# EAGLE design tweeq-Proto_BLE (EAGLE 6.4)
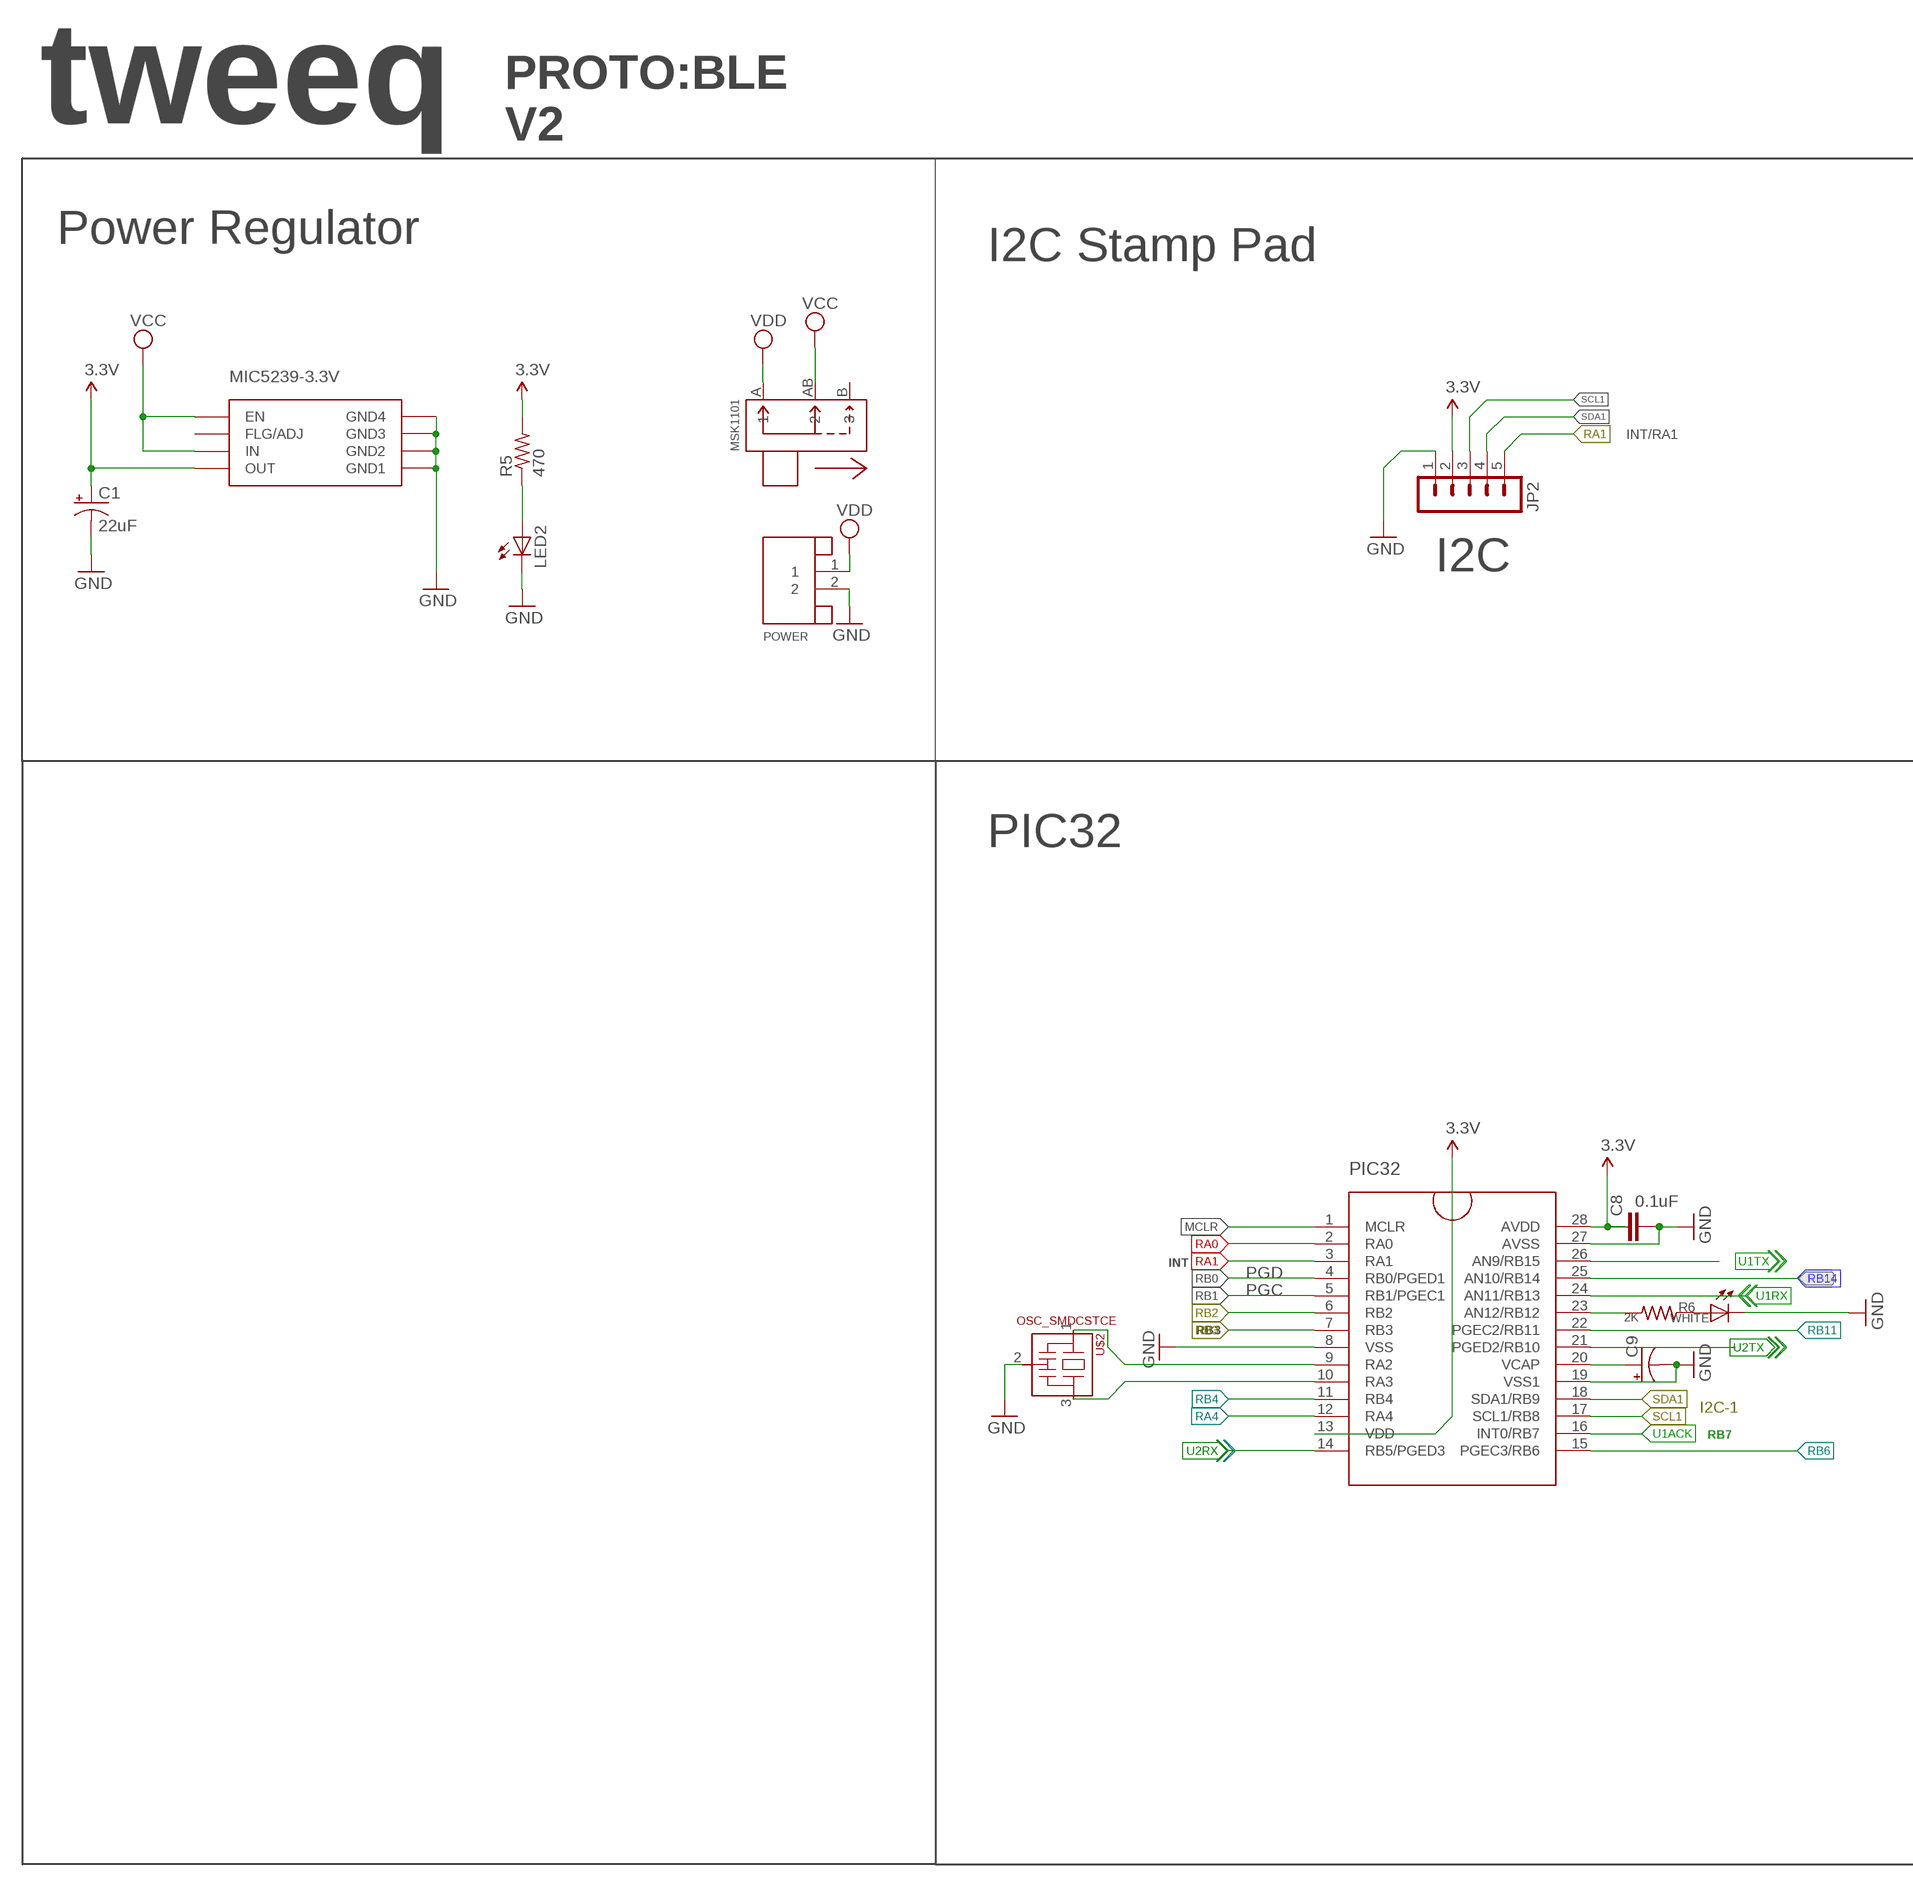
[diagram p0: schematic, sheet 1, part 1 of 2]
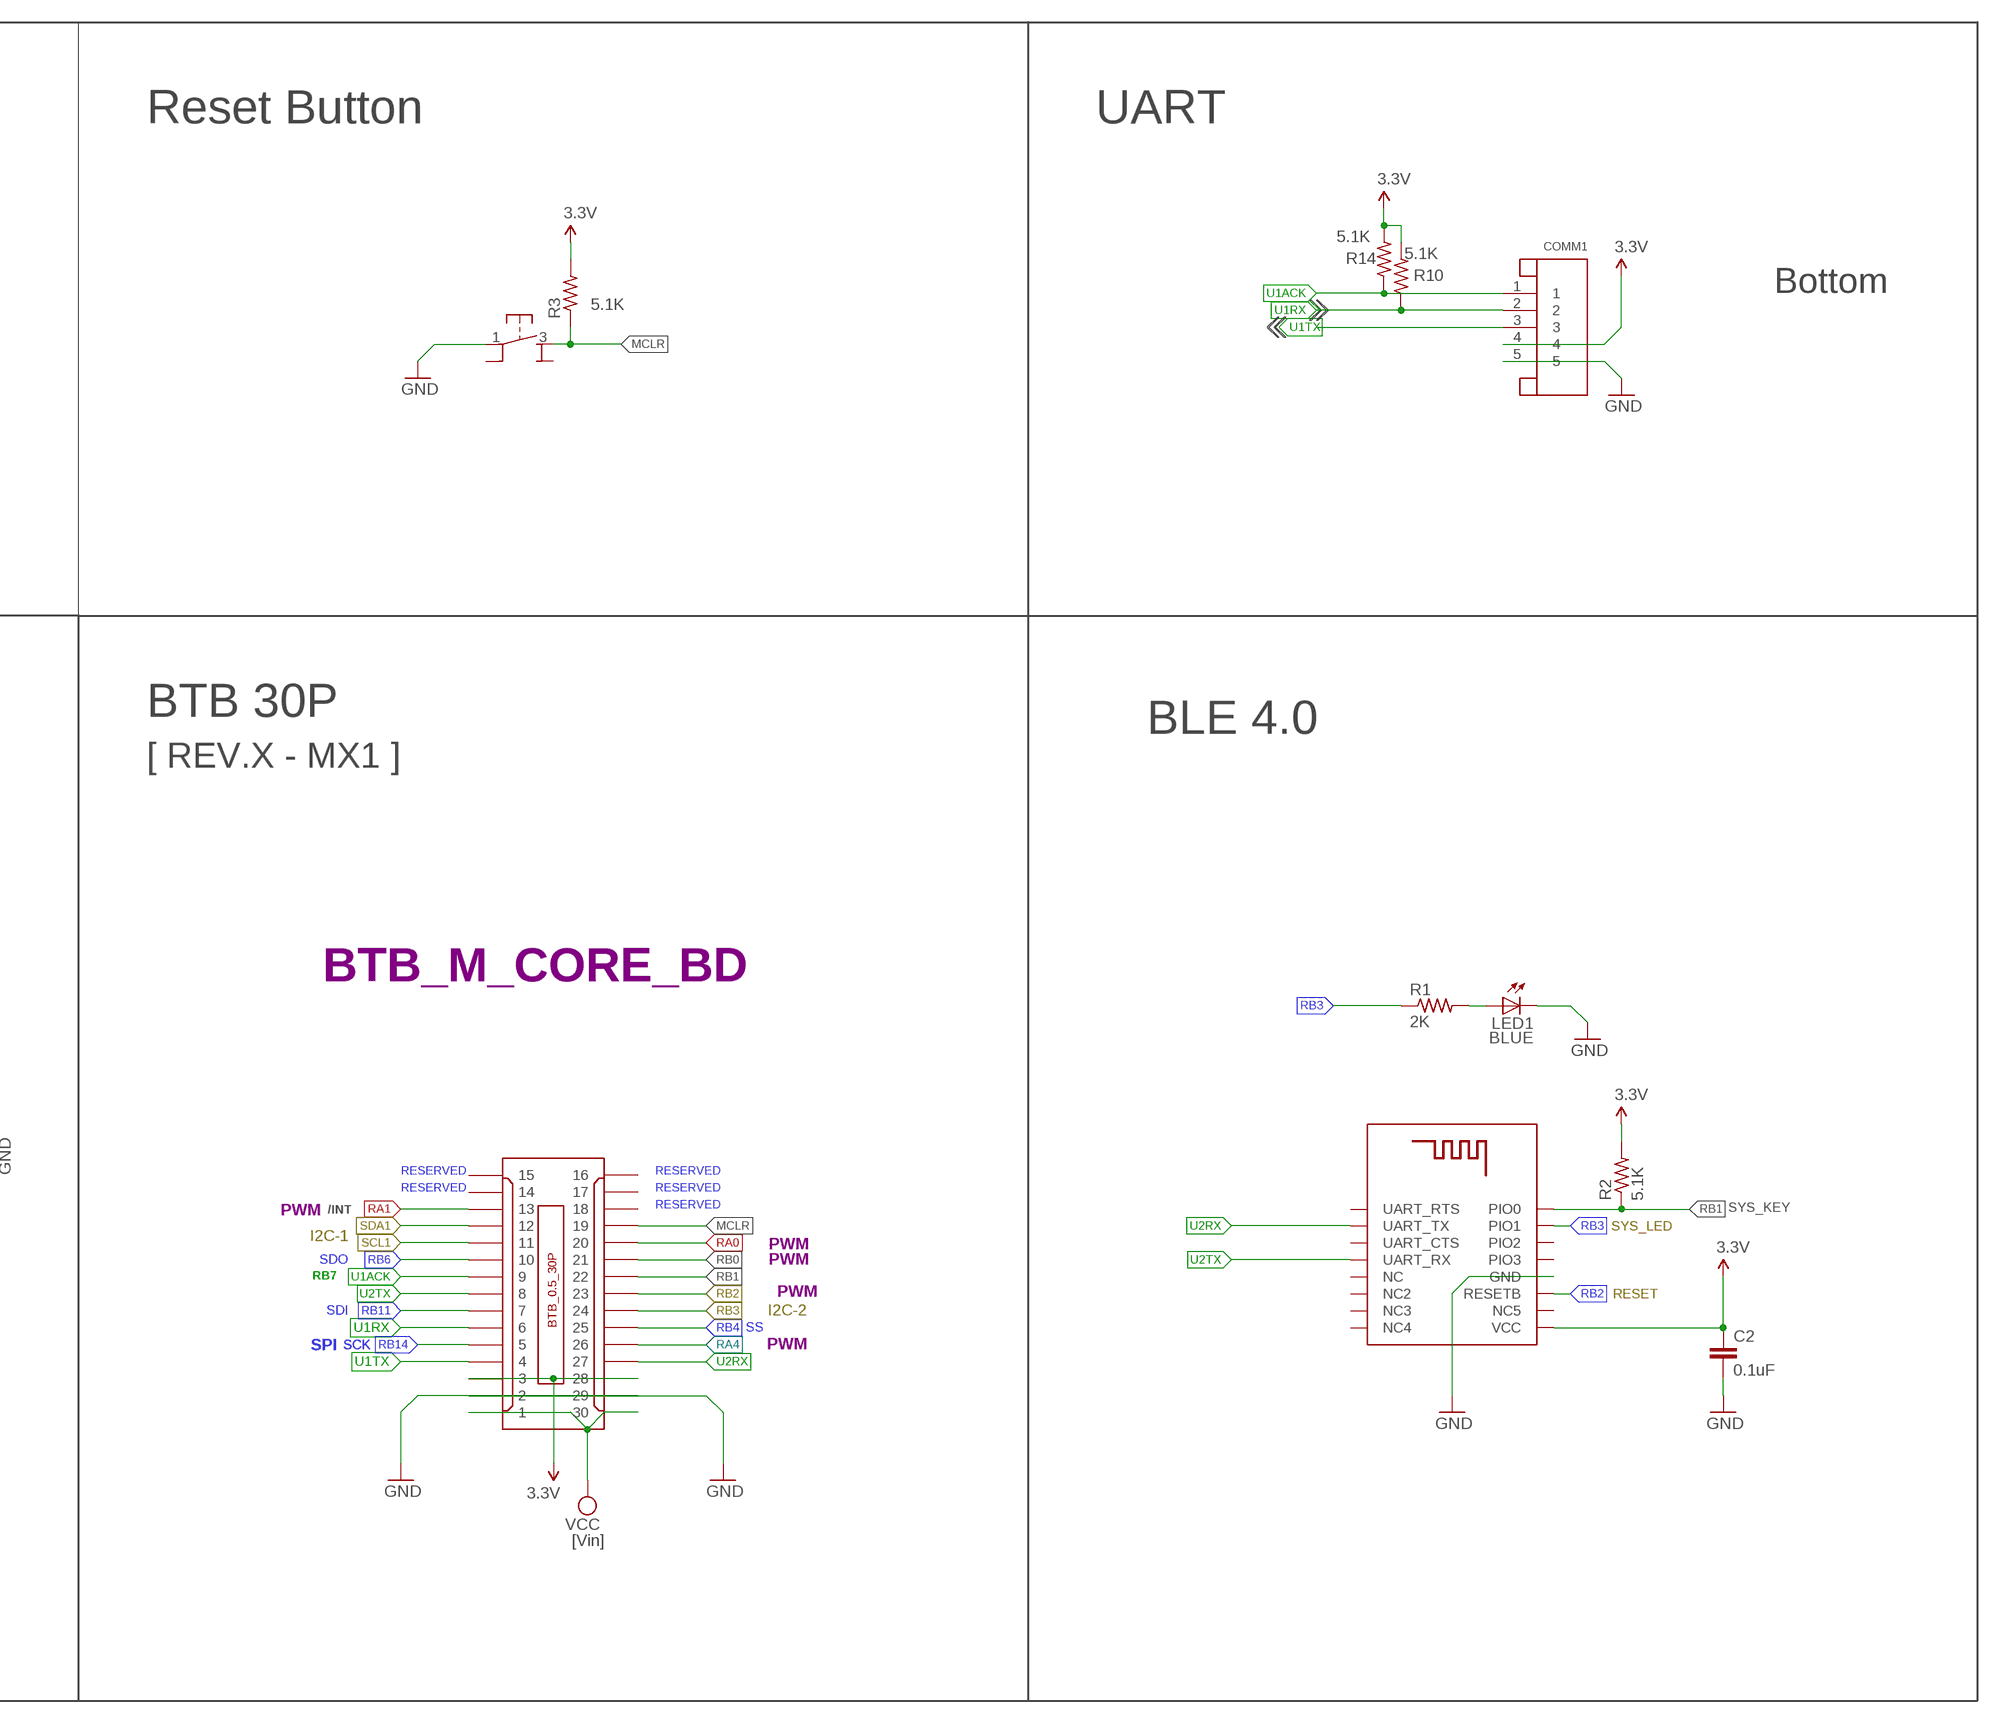
[diagram p1: schematic, sheet 1, part 2 of 2]

## Parts
C1  22uF  CPOL-USSMCB  [SMC_B]
C2  0.1uF  C-EUC0402K  [C0402K]
C8  0.1uF  C-EUC0402K  [C0402K]
C9  CPOL-USA/3216-18R  [A/3216-18R]
COMM1  JST-5PINSH  [SH1.0-5PIN]
JP2  M05-11.5MM-SMT  [1X05-1.5MM-SMT]
LED1  BLUE  LEDCHIP-LED0805  [CHIP-LED0805]
LED2  LEDCHIP-LED0805  [CHIP-LED0805]
MIC5239-3.3V  MIC5239-MM  [MSOP8]
MSK1101  SLIDE_SWITCH_MINI/MSK1101  [MSK1101]
PIC32  PIC32MX_1XX_2XX  [SSOP28]
PIC_LED  WHITE  LEDCHIP-LED0805  [CHIP-LED0805]
POWER  JST-2PINSH  [SH1.0-2PIN]
R1  2K  R-US_R0402  [R0402]
R2  5.1K  R-US_R0402  [R0402]
R3  5.1K  R-US_R0402  [R0402]
R5  470  R-US_R0402  [R0402]
R6  2K  R-US_R0402  [R0402]
R10  5.1K  R-US_R0402  [R0402]
R14  5.1K  R-US_R0402  [R0402]
U$1  BTB_CONN_30P/M  [BTB0.5-30M-3.0G]
U$2  OSC_SMDCSTCE  [CSTCE_RESONATOR_SMD]
U$3  EBLUE_BLE4.0_HM11HM11  [BLE4.0_HM11]
U$4  PB_MICRO_SMT  [PB_SMT_3.5X3X2]

## Nets
3.3V: C1.+ C2.1 C8.1 COMM1.4 JP2.2 MIC5239-3.3V.4(OUT) PIC32.13(VDD) PIC32.28(AVDD) R2.2 R3.2 R5.2 R10.2 R14.2 U$1.3 U$1.28 U$3.P$9(VCC)
GND: C1.- C2.2 C8.2 C9.- COMM1.5 JP2.1 LED1.C LED2.C MIC5239-3.3V.5(GND1) MIC5239-3.3V.6(GND2) MIC5239-3.3V.7(GND3) MIC5239-3.3V.8(GND4) PIC32.8(VSS) PIC32.19(VSS1) PIC32.27(AVSS) PIC_LED.C POWER.2 U$1.2 U$1.29 U$2.2(VSS) U$3.P$12(GND) U$4.1
LED: PIC32.23(AN12/RB12) R6.2
MCLR: PIC32.1(MCLR) R3.1 U$1.19 U$4.3
N$1: LED1.A R1.2
N$2: PIC32.9(RA2) U$2.1
N$3: PIC_LED.A R6.1
N$4: C9.+ PIC32.20(VCAP)
N$6: PIC32.10(RA3) U$2.3
N$19: LED2.A R5.1
RA0: PIC32.2(RA0) U$1.20
RA1: JP2.5 PIC32.3(RA1) U$1.13
RA4: PIC32.12(RA4) U$1.26
RB0: PIC32.4(RB0/PGED1) U$1.21
RB1: PIC32.5(RB1/PGEC1) R2.1 U$1.22 U$3.P$16(PIO0)
RB2: PIC32.6(RB2) U$1.23 U$3.P$11(RESETB)
RB3: PIC32.7(RB3) R1.1 U$1.24 U$3.P$15(PIO1)
RB4: PIC32.11(RB4) U$1.25
RB6: PIC32.15(PGEC3/RB6) U$1.10
RB11: PIC32.22(PGEC2/RB11) U$1.7
RB14: PIC32.25(AN10/RB14) U$1.5
SCL1: JP2.3 PIC32.17(SCL1/RB8) U$1.11
SDA1: JP2.4 PIC32.18(SDA1/RB9) U$1.12
U1ACK: COMM1.1 PIC32.16(INT0/RB7) R14.1 U$1.9
U1RX: COMM1.2 PIC32.24(AN11/RB13) R10.1 U$1.6
U1TX: COMM1.3 PIC32.26(AN9/RB15) U$1.4
U2RX: PIC32.14(RB5/PGED3) U$1.27 U$3.P$2(UART_TX)
U2TX: PIC32.21(PGED2/RB10) U$1.8 U$3.P$4(UART_RX)
VCC: MIC5239-3.3V.1(EN) MIC5239-3.3V.3(IN) MSK1101.AB U$1.1 U$1.30
VDD: MSK1101.A POWER.1
Unconnected: MIC5239-3.3V.2(FLG/ADJ) MSK1101.B U$1.14 U$1.15 U$1.16 U$1.17 U$1.18 U$3.P$1(UART_RTS) U$3.P$3(UART_CTS) U$3.P$5(NC) U$3.P$6(NC2) U$3.P$7(NC3) U$3.P$8(NC4) U$3.P$10(NC5) U$3.P$13(PIO3) U$3.P$14(PIO2) U$4.2(1A) U$4.4(2A)

## Notes on the sheet
- PROTO:BLE
- tweeq
- V2
- Power Regulator
- I2C Stamp Pad | Reset Button | UART
- Bottom
- INT/RA1
- I2C
- PIC32
- BTB 30P
- BLE 4.0
- [ REV.X - MX1 ]
- BTB_M_CORE_BD
- INT
- PGD
- PGC
- RESERVED | RESERVED
- RB3
- RESERVED | RESERVED
- PWM | /INT
- RESERVED
- SYS_KEY
- I2C-1 | SYS_LED
- PWM
- I2C-1 | SDO
- PWM
- RB7
- RB7
- PWM | RESET
- SDI
- I2C-2
- SS
- SPI
- SCK | SCK | PWM
- [Vin]

## Library data of the parts
C1 C9 = AISCube:CPOL-US: POLARIZED CAPACITOR, American symbol
C2 = AISCube:C-EU: CAPACITOR, European symbol
C8 = rcl:C-EU: CAPACITOR, European symbol
COMM1 = AISCube:JST-5PIN: JST 5 Pin
JP2 = AISCube:M05-1: PIN HEADER Standard 0.1" header pin 5 pins - 1 way
LED1 LED2 PIC_LED = AISCube:LED: LED OSRAM: - CHIPLED LG R971, LG N971, LY N971, LG Q971, LY Q971, LO R971, LY R971 LH N974, LH R974 LS Q976, LO Q976, LY Q976 LO Q996 - Hyper CHIPLED LW Q18S LB Q993, LB Q99A, LB R99A - SideLED LS A670, LO A670, LY A670, LG A670, LP A670 LB A673, LV A673, LT A673, LW A673 LH A674 LY A675 LS A676, LA A676, LO A676, LY A676, LW A676 LS A679, LY A679, LG A679 - Hyper Micro SIDELED® LS Y876, LA Y876, LO Y876, LY Y876 LT Y87S - SmartLED LW L88C, LW L88S LB L89C, LB L89S, LG L890 LS L89K, LO L89K, LY L89K LS L896, LA L896, LO L896, LY L896 - TOPLED LS T670, LO T670, LY T670, LG T670, LP T670 LSG T670, LSP T670, LSY T670, LOP T670, LYG T670 LG T671, LOG T671, LSG T671 LB T673, LV T673, LT T673, LW T673 LH T674 LS T676, LA T676, LO T676, LY T676, LB T676, LH T676, LSB T676, LW T676 LB T67C, LV T67C, LT T67C, LS T67K, LO T67K, LY T67K, LW E67C LS E67B, LA E67B, LO E67B, LY E67B, LB E67C, LV E67C, LT E67C LW T67C LS T679, LY T679, LG T679 LS T770, LO T770, LY T770, LG T770, LP T770 LB T773, LV T773, LT T773, LW T773 LH T774 LS E675, LA E675, LY E675, LS T675 LS T776, LA T776, LO T776, LY T776, LB T776 LHGB T686 LT T68C, LB T68C - Hyper Mini TOPLED® LB M676 - Mini TOPLED Santana® LG M470 LS M47K, LO M47K, LY M47K Source: http://www.osram.convergy.de/
MIC5239-3.3V = AISCube:MIC5239
MSK1101 = AISCube:SLIDE_SWITCH_MINI: Mini Slide Switches
PIC32 = AISCube:PIC32MX_1XX_2XX: PIC32MX1XX/2XX 32-bit Microcontrollers (up to 128 KB Flash and 32 KB SRAM) with Audio and Graphics Interfaces, USB, and Advanced Analog
POWER = AISCube:JST-2PIN
R1-R3 R5 R6 R10 R14 = AISCube:R-US_: RESISTOR, American symbol
U$1 = AISCube:BTB_CONN_30P: Board to Board Connector SMD 0.5mm Pitch 30 way - Dual Side (2x15) Total Mating height: 3.0mm
U$2 = AISCube:OSC_SMD: OSC
U$3 = AISCube:EBLUE_BLE4.0_HM11
U$4 = AISCube:PB_MICRO_SMT

## Board
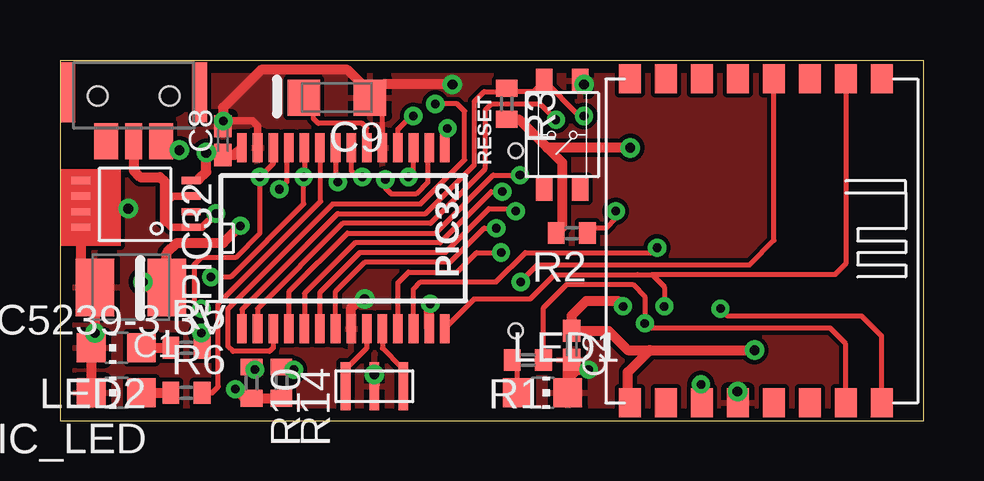
[diagram p2: board, top side]
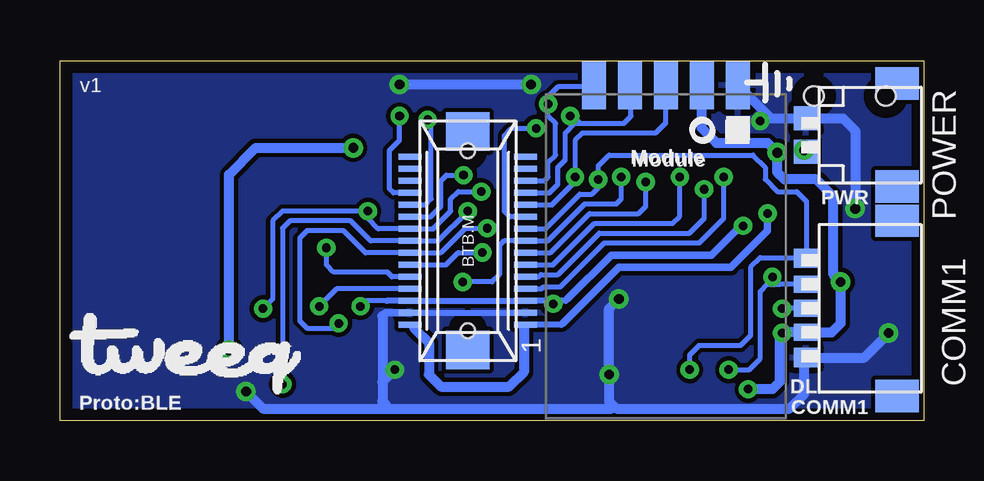
[diagram p3: board, bottom side, seen from below]

Size 36 x 15 mm. Coordinates in mm from the lower left corner, seen from the top.
Outline: 0,0 36,0 36,15 0,15 0,0
Copper layers (1*16): Top 0.0356mm / dielectric 1.5011mm / Bottom 0.0356mm
Design rules "AISCube": minimum track width 7mil, minimum drill 14mil, track to track 7mil, track to pad 7mil, pad to pad 7mil, via to via 7mil, smd to smd 0mil, copper to edge 20mil, drill to drill 8mil, minimum pad ring 10mil, minimum via ring 8mil, stop-mask expansion 4mil, vias tented up to drill 32mil, thermal gap 10mil

### Footprints (pad centres in the part's own frame; a part is rotated, then mirrored left to right if it is on the bottom)
SMC_B = smd 1.6 x 2.4: + -1.5,0; - 1.5,0
C0402K = smd 0.925 x 0.74: 1 -0.6,0; 2 0.6,0
A/3216-18R = smd 1.35 x 1.5: + 1.375,0; - -1.375,0
SH1.0-5PIN = smd 0.8 x 1: 1 -2.09,-0.55; 5 2.05,-0.55 | smd 0.7 x 1: 2 -1,-0.55; 3 0,-0.55; 4 1,-0.55 | smd 1.35 x 1.8: P$1 -3.65,3.25; P$2 3.65,3.25
1X05-1.5MM-SMT = smd 1 x 2: 1 6,0; 2 4.5,0; 3 3,0; 4 1.5,0; 5 0,0
CHIP-LED0805 = smd 1.2 x 1.2: A 0,-1.05; C 0,1.05
MSOP8 = smd 0.8 x 0.3: 1 -2.1,-0.55; 2 -2.1,-1.2; 3 -2.1,-1.85; 4 -2.1,-2.5; 5 2.5,-2.5; 6 2.5,-1.85; 7 2.5,-1.2; 8 2.5,-0.55
MSK1101 = smd 1 x 1.5: A -1.15,0.55; B 1.15,0.55 | smd 0.7 x 1.5: AB 0,0.55 | smd 0.635 x 2.5: P$1 -2.75,-1.5; P$2 2.75,-1.5 | hole 0.8: -1.5,-1.35; 1.5,-1.35
SSOP28 = smd 0.4 x 1.2: 1 -4.225,-3.77; 2 -3.575,-3.77; 3 -2.925,-3.77; 4 -2.275,-3.77; 5 -1.625,-3.77; 6 -0.975,-3.77; 7 -0.325,-3.77; 8 0.325,-3.77; 9 0.975,-3.77; 10 1.625,-3.77; 11 2.275,-3.77; 12 2.925,-3.77; 13 3.575,-3.77; 14 4.225,-3.77; 15 4.225,3.77; 16 3.575,3.77; 17 2.925,3.77; 18 2.275,3.77; 19 1.625,3.77; 20 0.975,3.77; 21 0.325,3.77; 22 -0.325,3.77; 23 -0.975,3.77; 24 -1.625,3.77; 25 -2.275,3.77; 26 -2.925,3.77; 27 -3.575,3.77; 28 -4.225,3.77
SH1.0-2PIN = smd 1 x 1: 1 0.7,-0.55; 2 -0.7,-0.55 | smd 1.35 x 1.8: P$1 -2.15,3.25; P$2 2.15,3.25
R0402 = smd 0.7 x 0.9: 1 -0.65,0; 2 0.65,0
BTB0.5-30M-3.0G = smd 0.25 x 0.95: 1 -3.495,-2.41; 2 -2.995,-2.41; 3 -2.495,-2.41; 4 -1.995,-2.41; 5 -1.495,-2.41; 6 -0.995,-2.41; 7 -0.495,-2.41; 8 0.005,-2.41; 9 0.505,-2.41; 10 1.005,-2.41; 11 1.505,-2.41; 12 2.005,-2.41; 13 2.505,-2.41; 14 3.005,-2.41; 15 3.505,-2.41; 16 3.505,2.41; 17 3.005,2.41; 18 2.505,2.41; 19 2.005,2.41; 20 1.505,2.41; 21 1.005,2.41; 22 0.505,2.41; 23 0.005,2.41; 24 -0.495,2.41; 25 -0.995,2.41; 26 -1.495,2.41; 27 -1.995,2.41; 28 -2.495,2.41; 29 -2.995,2.41; 30 -3.495,2.41 | smd 1.6 x 1.8: P$1 -4.545,0; P$2 4.555,0 | hole 0.6: -3.745,0; 3.755,0
CSTCE_RESONATOR_SMD = smd 0.4 x 2: 1 1.2,0; 2 0,0; 3 -1.2,0
BLE4.0_HM11 = smd 1.2 x 0.9: P$1 -6.75,12; P$2 -6.75,10.5; P$3 -6.75,9; P$4 -6.75,7.5; P$5 -6.75,6; P$6 -6.75,4.5; P$7 -6.75,3; P$8 -6.75,1.5; P$9 6.75,1.5; P$10 6.75,3; P$11 6.75,4.5; P$12 6.75,6; P$13 6.75,7.5; P$14 6.75,9; P$15 6.75,10.5; P$16 6.75,12
PB_SMT_3.5X3X2 = smd 1 x 0.7: 1 -2.25,0.75; 2 2.25,0.75; 3 -2.25,-0.75; 4 2.25,-0.75

### Placement (x,y rotation side)
C1  2.96,5.56 180 top
C2  21.34,3.15 270 top
C8  6.79,11.68 90 top
C9  11.55,13.47 180 top
COMM1  4.35,4.69 270 bottom
JP2  13.74,13.99 0 bottom
LED1  20.12,1.17 270 top
LED2  2.35,3.05 90 top
MIC5239-3.3V  3.36,7.52 180 top
MSK1101  3.07,12.19 180 top
PIC32  11.81,7.61 0 top
PIC_LED  2.35,1.17 90 top
POWER  4.35,11.91 270 bottom
R1  19.51,2.54 180 top
R2  21.34,7.82 180 top
R3  18.63,13.22 270 top
R5  5.27,3.05 0 top
R6  5.27,1.17 0 top
R10  7.99,1.59 270 top
R14  9.24,1.59 270 top
U$1  19,7.5 90 bottom
U$2  13.11,1.45 180 top
U$3  22.26,7.5 270 top
U$4  20.94,11.91 270 top
U$6  [TWEEQ-LOGO-M]  35.6,1.1 0 bottom

### Tracks (layer width: path | path; a pad name or v marks a point on that pad's centre or on a via)
3.3V  (via drill 0.36, 0.41)
  Top 0.305: MIC5239-3.3V.4 5.75,10.02 5.79,10.06
  Top 0.406: 5.79,10.06 6.1,10.36 v6.1,11.18 6.7,11.18 C8.1 7.29,11.08 PIC32.28 | R14.2 R10.2 7.92,1.02 7.62,1.02 v7.32,1.32 | v7.52,8.13 6.81,7.42 4.88,7.42 4.46,7 C1.+ 3.68,5.56 v3.45,5.79 | PIC32.13 15.39,4.82 v15.44,4.88 | R5.2 5.92,3.63 v5.89,3.66 | U$3.P$9 23.67,0.84 23.67,2.03 24.59,2.95 | v23.47,4.78 23.24,5 21.95,5 21.34,4.39 C2.1 22.87,3.75 23.67,2.95 24.59,2.95 | R2.2 20.93,8.07 20.93,10.77 20.32,11.38 | R3.2 19.13,12.57 20.32,11.38 | 24.59,2.95 v28.96,2.95 | v23.77,11.38 20.32,11.38
  Bottom 0.203: 22.38,5 23.24,5 v23.47,4.78
  Bottom 0.254: 14.83,5.08 14.91,5 15.57,5 | v15.44,4.88 15.57,5 | 15.57,5 U$1.3 U$1.28 22.38,5
  Bottom 0.305: 7.62,8.13 8.84,6.91 13.01,6.91 14.83,5.08
  Bottom 0.406: v7.52,8.13 7.62,8.13 | v7.32,1.32 6.3,1.32 5.99,1.63 5.99,3.56 v5.89,3.66 5.86,3.69 COMM1.4 3.83,3.69 3.45,4.06 v3.45,5.79 3.76,6.1 3.76,9.35 4.47,10.06 5.79,10.06 6.1,10.36 v6.1,11.18 6.5,11.58 8.64,11.58 9.25,12.2 9.24,12.2 JP2.2 | v28.96,2.95 28.96,10.26 27.84,11.38 v23.77,11.38
GND  (via drill 0.36, 0.41)
  Top 0.203: 21.88,14.16 U$4.1 v21.83,14.02 v21.84,14.02 | PIC32.19 13.44,12.96 C9.-
  Top 0.305: PIC32.27 8.24,12.29 8.03,12.5 v6.81,12.5
  Top 0.406: MIC5239-3.3V.5 MIC5239-3.3V.6 MIC5239-3.3V.7 | MIC5239-3.3V.7 MIC5239-3.3V.8 0.86,6.16 C1.- v1.46,3.66 1.46,3.21 LED2.C PIC_LED.C | v2.85,8.84 1.08,8.84 MIC5239-3.3V.7 | PIC32.8 12.14,4.72 12.5,5.08 v12.7,5.08 | v13.11,1.93 U$2.2 | v16.36,14.02 13.47,14.02 C9.- 12.92,13.7 11.99,14.63 8.38,14.63 6.79,13.05 C8.2 6.79,12.48 v6.81,12.5 | C2.2 21.17,2.38 LED1.C 21.17,1.76 21.54,2.13 v22.05,2.13 | U$3.P$12 28.26,1.21 v28.25,1.22
  Bottom 0.254: U$1.29 U$1.2
  Bottom 0.305: U$1.29 22.42,4.5 22.55,4.37
  Bottom 0.406: v2.85,8.84 2.85,12.09 3.36,12.61 POWER.2 6.36,12.61 | 12.9,0.61 13.11,0.81 v13.11,1.93 13.11,4.67 v12.7,5.08 | 12.9,0.61 12.8,0.51 5.59,0.51 4.98,1.12 4.98,2.56 COMM1.5 2.48,2.64 v1.46,3.66 | 22.55,4.37 22.55,1.63 | 22.55,1.63 22.55,0.81 22.25,0.51 | 22.25,0.51 13.01,0.51 12.9,0.61 | v21.84,14.02 v16.36,14.02 | JP2.1 6.36,12.61 | 6.36,12.61 6.69,12.61 v6.81,12.5 | v22.05,2.13 22.55,1.63 | v28.25,1.22 27.53,0.51 22.25,0.51
  pour Bottom: 0.11,14.83 35.87,14.83 35.87,0.1 0.11,0.1
  pour Top: 0.11,14.83 35.87,14.83 35.87,0.1 0.11,0.1
LED
  Top 0.203: R6.2 6.35,1.17 6.6,1.42 6.6,4.88 10.87,9.14 10.87,11.35 PIC32.23
MCLR  (via drill 0.36)
  Top 0.203: PIC32.1 7.59,4.64 11.58,8.64 15.24,8.64 17.27,10.67 17.27,13.31 17.68,13.72 18.48,13.72 R3.1 18.78,13.72 19.71,13.72 20.16,14.16 U$4.3 21.64,12.71 21.64,12.7 v21.84,12.7
  Bottom 0.203: U$1.19 22.1,9.51 22.25,9.65 22.25,11.28 21.84,11.68 v21.84,12.7
N$1
  Top 0.203: LED1.A 19.07,2.33 R1.2
N$2
  Top 0.203: PIC32.9 12.79,3.03 11.99,2.23 11.89,2.23 11.89,1.47 U$2.1
N$3
  Top 0.406: PIC_LED.A R6.1
N$4
  Top 0.203: PIC32.20 12.79,12.21 12.6,12.39 10.77,12.39 10.57,12.6 10.57,13.08 C9.+
N$6
  Top 0.203: PIC32.10 13.44,3.02 14.22,2.23 14.22,1.53 U$2.3
N$19
  Top 0.406: LED2.A R5.1
RA0  (via drill 0.36)
  Top 0.203: v20.68,12.55 20.02,13.21 17.98,13.21 17.73,12.95 17.73,10.52 15.44,8.23 11.79,8.23 8.24,4.68 PIC32.2
  Bottom 0.203: U$1.20 20.76,9.01 20.52,9.25 20.52,12.39 v20.68,12.55
RA1  (via drill 0.36)
  Top 0.203: PIC32.3 8.89,3.05 8.74,2.9 7.21,2.9 7.01,3.1 7.01,4.67 11.38,9.04 15.04,9.04 16.87,10.87 16.87,12.9 16.56,13.21 v15.65,13.21
  Bottom 0.203: U$1.13 15.8,10.01 15.65,10.16 15.65,10.77 15.34,11.07 15.34,12.39 15.65,12.7 v15.65,13.21 15.65,13.51 15.24,13.92 13.84,13.92 JP2.5
RA4  (via drill 0.36)
  Top 0.203: PIC32.12 14.74,5.49 15.04,5.79 18.19,5.79 19.41,7.01 24.69,7.01 v24.89,7.21
  Bottom 0.203: U$1.26 22.16,6 22.35,6.2 24.59,6.2 24.89,6.5 v24.89,7.21
RB0  (via drill 0.36)
  Top 0.203: PIC32.4 9.54,5.37 11.99,7.82 15.65,7.82 18.06,10.24 v19.18,10.24
  Bottom 0.203: U$1.21 20.55,8.51 20.12,8.94 20.12,10.01 19.89,10.24 v19.18,10.24
RB1  (via drill 0.36)
  Top 0.203: PIC32.5 10.19,5.31 12.29,7.42 15.85,7.42 17.98,9.55 v18.44,9.55 | v23.16,8.74 23.16,8.43 22.76,8.03 22.19,8.03 R2.1 | U$3.P$16 34.26,3.54 33.43,4.37 27.84,4.37 v27.53,4.67
  Bottom 0.203: v18.44,9.55 19.41,9.55 19.71,9.25 19.71,8.74 20.44,8.01 U$1.22 22.74,8.01 23.16,8.43 v23.16,8.74 26.72,8.74 27.13,8.33 27.13,5.08 v27.53,4.67
RB2  (via drill 0.36)
  Top 0.203: PIC32.6 10.84,5.35 12.5,7.01 16.05,7.01 17.88,8.84 18.9,8.84 v19,8.74 | v26.72,1.52 26.72,0.79 U$3.P$11
  Bottom 0.203: 18.95,8.79 v19,8.74 20.23,7.5 U$1.23 23.05,7.5 23.88,8.33 26.42,8.33 26.72,8.03 v26.72,1.52
RB3  (via drill 0.36)
  Top 0.203: PIC32.7 11.49,5.39 12.7,6.6 16.26,6.6 17.68,8.03 v18.19,8.03 | R1.1 20.16,4.71 21.13,5.69 23.88,5.69 24.38,5.18 v24.38,4.06 24.59,3.86 32.11,3.86 32.76,3.21 U$3.P$15
  Bottom 0.203: v18.19,8.03 19.1,8.03 20.12,7.01 21.39,7.01 U$1.24 23.26,7 24.18,7.92 25.7,7.92 26.01,7.62 26.01,4.17 25.7,3.86 24.59,3.86 v24.38,4.06
RB4  (via drill 0.36)
  Top 0.203: PIC32.11 14.09,5.76 14.53,6.2 16.56,6.2 17.37,7.01 v18.39,7.01
  Bottom 0.203: U$1.25 19.91,6.5 19.41,7.01 v18.39,7.01
RB6  (via drill 0.36)
  Top 0.203: PIC32.15 16.04,12.07 v16.15,12.19
  Bottom 0.203: U$1.10 17.24,8.51 17.48,8.74 17.48,11.89 17.17,12.19 v16.15,12.19
RB11  (via drill 0.36)
  Top 0.203: v11.58,9.96 11.48,10.06 PIC32.22
  Bottom 0.203: U$1.7 15.54,7.01 13.92,8.64 11.89,8.64 11.58,8.94 v11.58,9.96
RB14  (via drill 0.36)
  Top 0.203: PIC32.25 9.54,11.27 9.45,11.18 9.45,9.96 v9.14,9.65
  Bottom 0.203: v9.14,9.65 9.14,8.43 9.75,7.82 13.51,7.82 15.24,6.1 15.95,6.1 16.04,6 U$1.5
SCL1  (via drill 0.36)
  Top 0.203: v14.53,10.16 14.74,10.37 PIC32.17
  Bottom 0.203: U$1.11 15.48,9.01 14.53,9.96 v14.53,10.16 14.53,11.68 14.22,11.99 11.18,11.99 10.75,12.41 10.75,13.98 JP2.3
SDA1  (via drill 0.36)
  Top 0.203: PIC32.18 14.09,12.16 14.63,12.7 v14.73,12.7
  Bottom 0.203: U$1.12 15.59,9.51 15.24,9.86 15.24,10.57 14.94,10.87 14.94,11.99 14.53,12.39 14.33,12.39 | 14.33,12.39 12.5,12.39 12.19,12.7 12.19,13.94 JP2.4 | 14.33,12.39 14.63,12.7 v14.73,12.7
U1ACK  (via drill 0.36)
  Top 0.203: PIC32.16 15.34,11.33 15.34,9.96 14.83,9.45 13.82,9.45 13.56,9.7 v13.56,10.06 | v9.75,2.13 9.35,2.13 R14.1
  Bottom 0.203: v9.75,2.13 9.75,2.74 9.35,3.15 7.62,3.15 7.21,3.56 7.21,6.4 6.81,6.81 4.93,6.81 COMM1.1 4.9,6.84 4.88,6.86 4.88,9.14 5.28,9.55 6.1,9.55 6.6,10.06 6.6,10.57 7.11,11.07 13.11,11.07 13.56,10.62 v13.56,10.06 13.56,9.7 13.82,9.45 14.33,9.45 15.77,8.01 U$1.9
U1RX  (via drill 0.36)
  Top 0.203: v6.3,5.99 7.11,5.99 10.16,9.04 v10.16,10.16 10.19,10.19 PIC32.24 | 8.02,2.24 R10.1 8.1,2.13 v8.13,2.13
  Bottom 0.203: COMM1.2 5.99,5.69 | v8.13,2.13 7.26,2.13 6.81,2.59 6.81,5.38 6.5,5.69 5.99,5.69 | 5.99,5.69 v6.3,5.99 | U$1.6 15.44,6.5 13.72,8.23 10.46,8.23 10.16,8.53 v10.16,10.16
U1TX  (via drill 0.36)
  Top 0.203: v5.89,4.67 5.59,4.98 5.59,6.5 5.89,6.81 7.32,6.81 8.33,7.82 v8.33,10.16 8.89,10.72 PIC32.26
  Bottom 0.203: COMM1.3 5.88,4.69 v5.89,4.67 | v8.33,10.16 8.33,8.43 9.35,7.42 13.31,7.42 15.14,5.59 15.85,5.59 15.93,5.5 U$1.4
U2RX  (via drill 0.36)
  Top 0.203: 16.05,4 PIC32.14 17.28,5.08 19.61,5.08 20.62,6.1 24.08,6.1 24.69,6.1 | U$3.P$2 32.76,6.55 32.31,6.1 24.69,6.1 | 24.69,6.1 25.2,5.59 v25.2,4.78
  Bottom 0.203: U$1.27 24.47,5.5 v25.2,4.78
U2TX  (via drill 0.36)
  Top 0.203: v12.6,10.16 12.39,10.16 12.14,10.42 PIC32.21 | v19.2,5.79 19.91,6.5 28.75,6.5 29.77,7.52 U$3.P$4
  Bottom 0.203: 16.58,7.52 U$1.8 | U$1.8 17.49,7.5 17.68,7.32 17.68,6.1 17.98,5.79 v19.2,5.79 | U$1.8 15.66,7.5 14.12,9.04 12.8,9.04 12.6,9.25 v12.6,10.16
VCC  (via drill 0.36)
  Top 0.305: 4.37,8.33 4.63,8.07 MIC5239-3.3V.1 5.93,8.07 v6.5,8.64 | MIC5239-3.3V.3 4.7,9.37 4.37,9.04
  Top 0.406: MSK1101.AB 3.07,10.44 3.35,10.16 4.17,10.16 4.37,9.96 4.37,9.04 4.37,8.33
  Bottom 0.203: U$1.1 16.59,3.93 16.66,3.86 | U$1.30 21.25,3.86 21.23,3.86
  Bottom 0.254: 15.04,4.06 15.1,4 U$1.1
  Bottom 0.305: 15.04,4.06 12.7,6.4 8.03,6.4 6.5,7.92 v6.5,8.64
  Bottom 0.406: 16.66,3.86 16.66,2.03 17.27,1.42 20.12,1.42 20.62,1.93 20.62,3.25 21.23,3.86
VDD  (via drill 0.41)
  Top 0.406: v4.98,11.28 4.59,11.28 MSK1101.A
  Bottom 0.406: POWER.1 v4.98,11.28
(copper drawn outside any net)
  shapes: Top area x1

### Text on the board
tPlace: RESET | PIC32
bPlace: v1 | Module | PWR | DL | COMM1 | Proto:BLE